# EAGLE design brick_i2c_humidity (EAGLE 7.3.0)
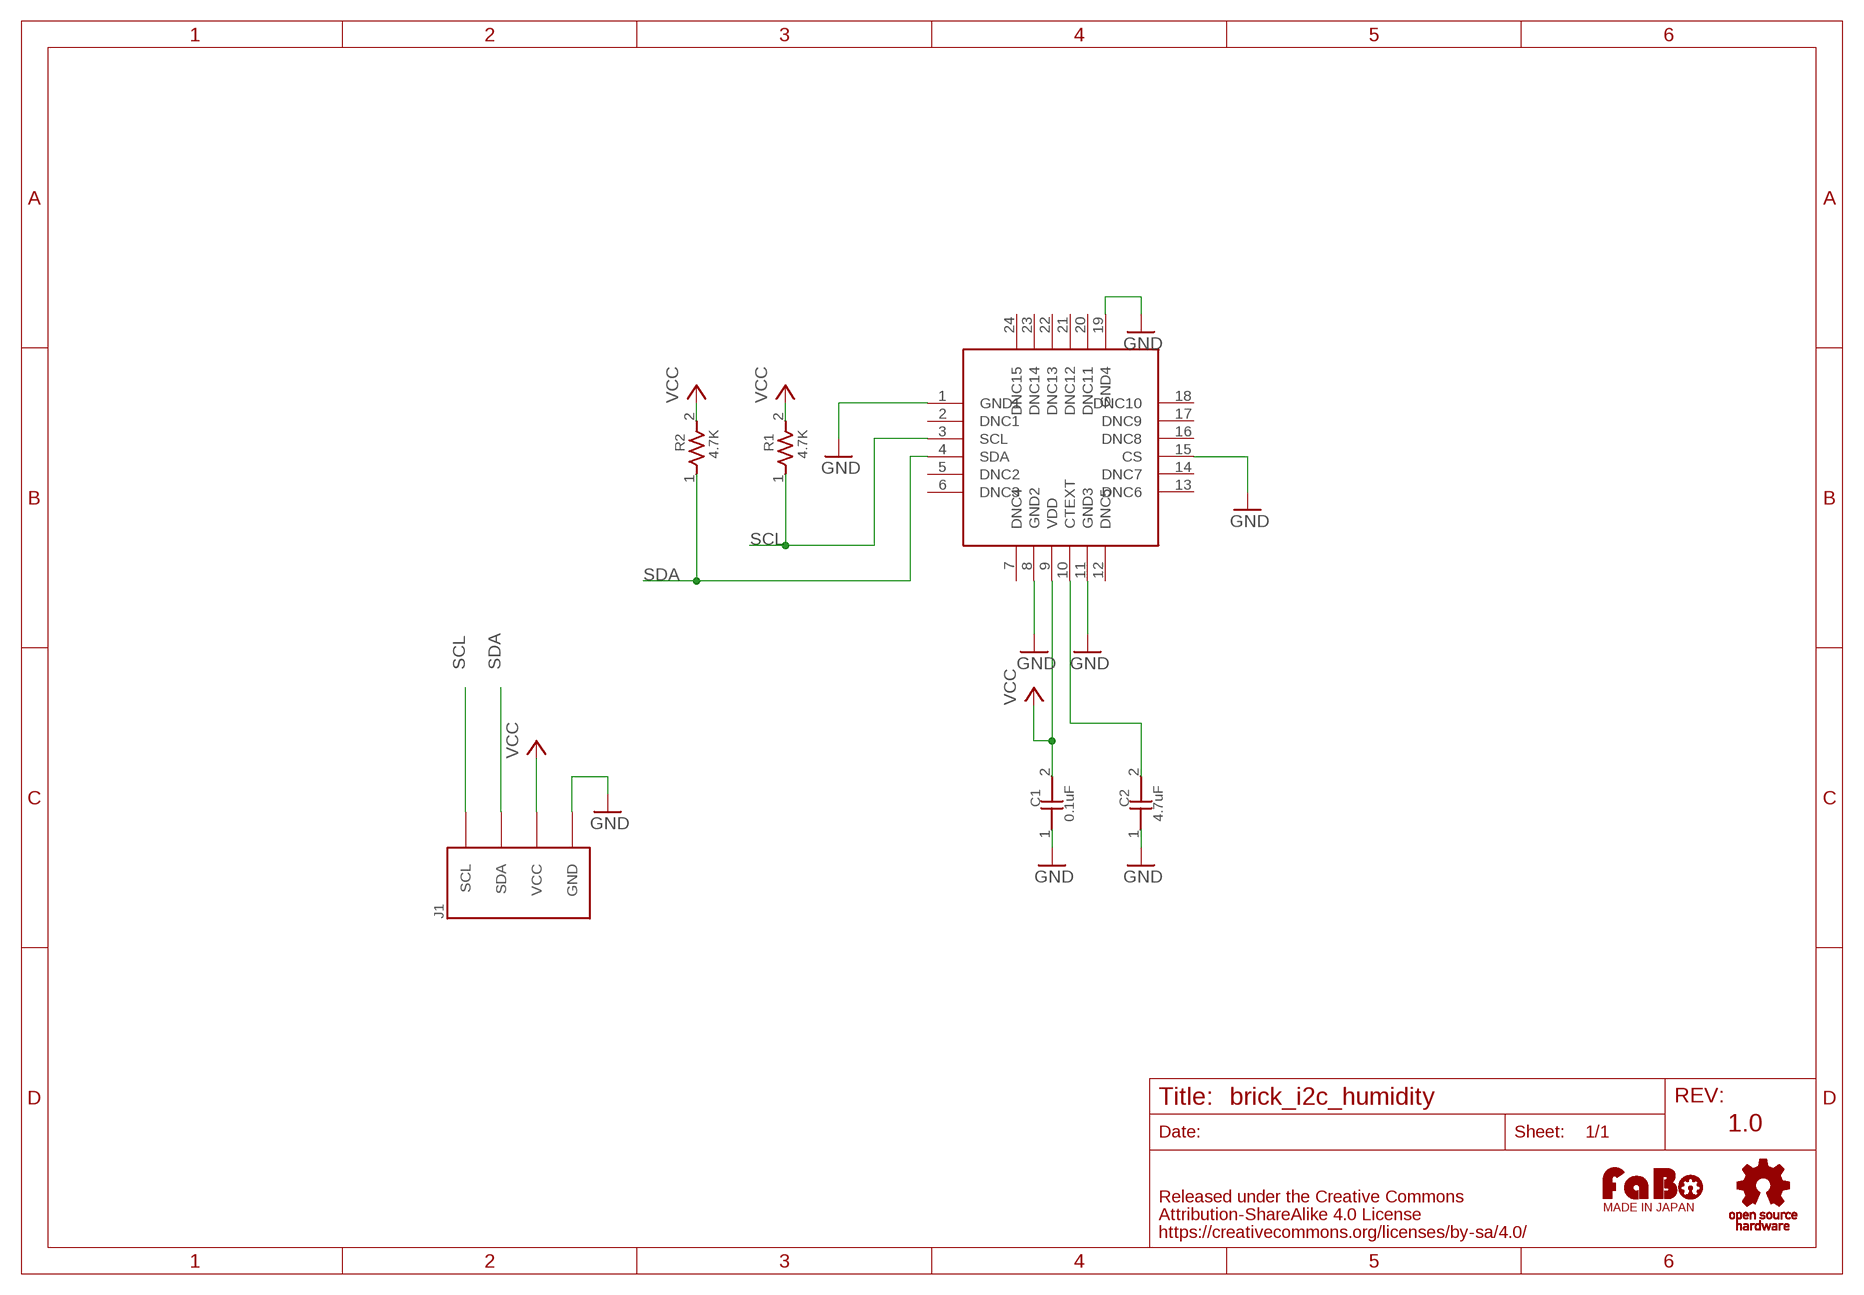
[diagram p0: schematic, sheet 1]

## Parts
C1  0.1uF  CAPACITOR0603  [0603]
C2  4.7uF  CAPACITOR0603  [0603]
J1  BRICK_I2C  [BRICK_I2C]
R1  4.7K  RESISTOR0603  [0603]
R2  4.7K  RESISTOR0603  [0603]
SI1  SILICONLAB-SI7005  [SILICONLAB-SI7005]
U$2  LOGO_FABO-M  [LOGO_FABO_M]
U$4  LOGO_OSHW_T-M  [LOGO_OSHW_T_M]

## Nets
GND: C1.1 C2.1 J1.GND SI1.1(GND1) SI1.8(GND2) SI1.11(GND3) SI1.15(CS) SI1.19(GND4)
N$1: C2.2 SI1.10(CTEXT)
SCL: J1.SCL R1.1 SI1.3(SCL)
SDA: J1.SDA R2.1 SI1.4(SDA)
VCC: C1.2 J1.VCC R1.2 R2.2 SI1.9(VDD)
Unconnected: SI1.2(DNC1) SI1.5(DNC2) SI1.6(DNC3) SI1.7(DNC4) SI1.12(DNC5) SI1.13(DNC6) SI1.14(DNC7) SI1.16(DNC8) SI1.17(DNC9) SI1.18(DNC10) SI1.20(DNC11) SI1.21(DNC12) SI1.22(DNC13) SI1.23(DNC14) SI1.24(DNC15)

## Notes on the sheet
- 1.0

## Library data of the parts
C1 C2 = GClue-Capacitor:CAPACITOR
J1 = gclue:BRICK_I2C: FaBo Brick 4pin(I2C)
R1 R2 = GClue-Resistors:RESISTOR
SI1 = gclueSensor:SILICONLAB-SI7005
U$2 = FaBo:LOGO_FABO
U$4 = gclue:LOGO_OSHW_T

## Board
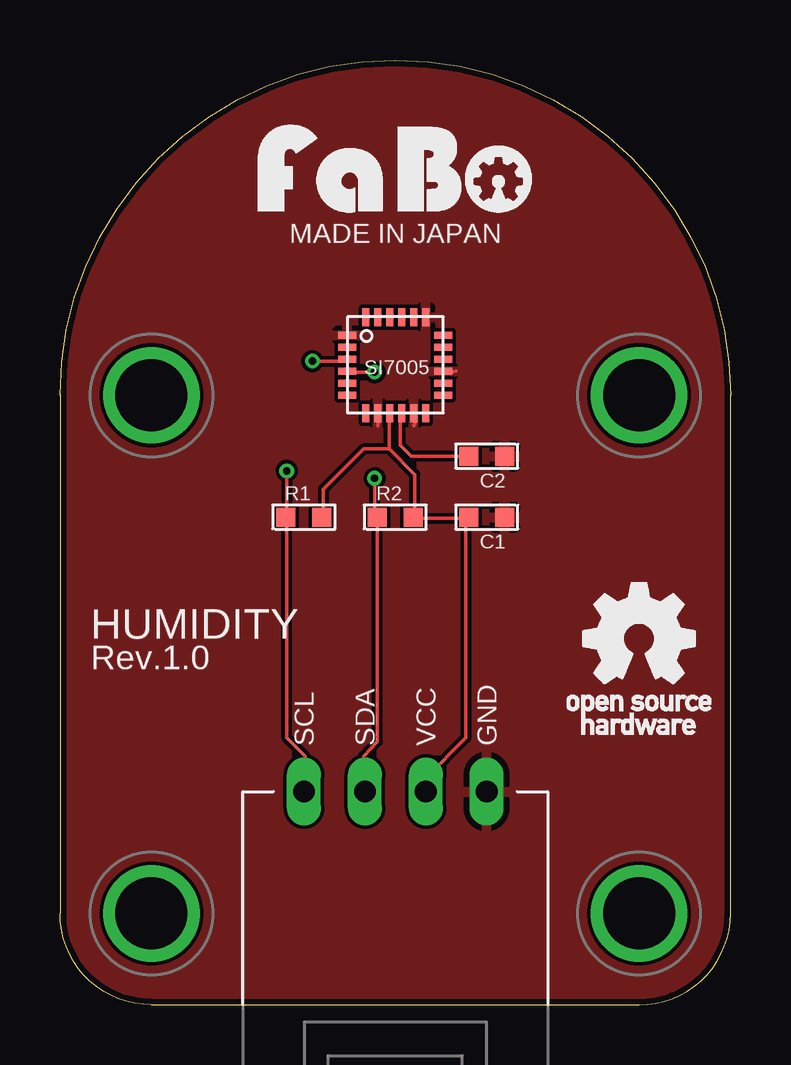
[diagram p1: board, top side]
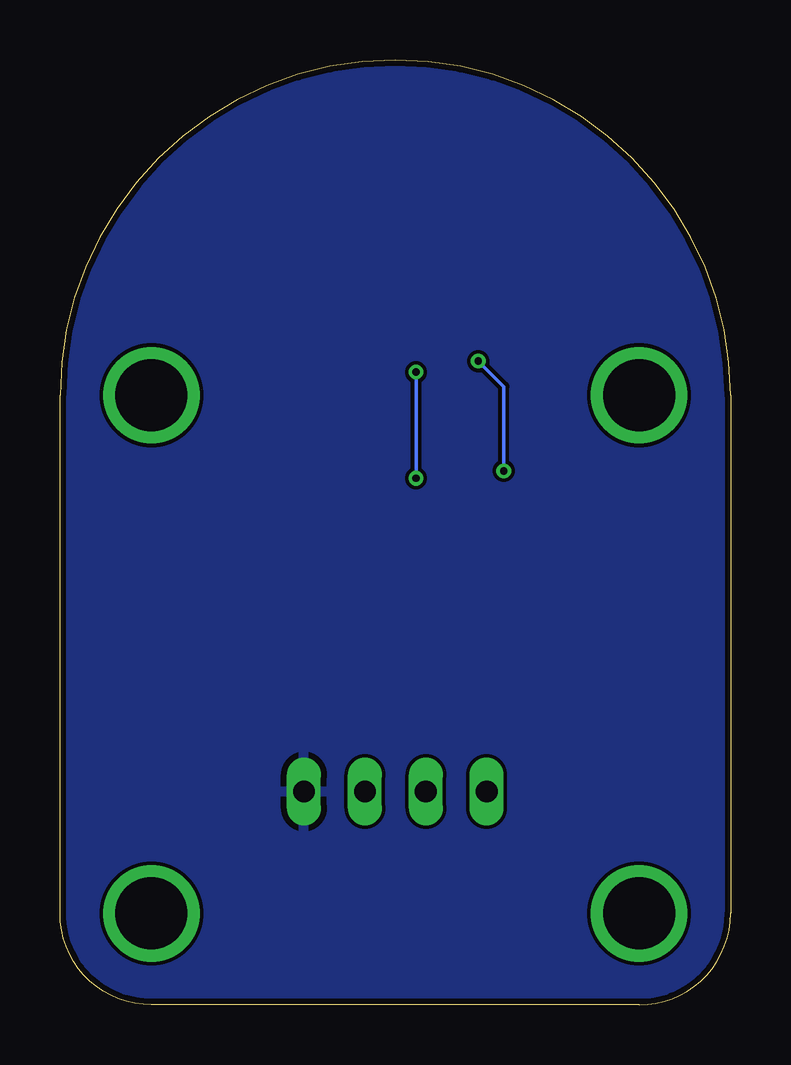
[diagram p2: board, bottom side, seen from below]

Size 27.94 x 39.37 mm. Coordinates in mm from the lower left corner, seen from the top.
Copper layers (1*16): Top 0.035mm / dielectric 1.5mm / Bottom 0.035mm
Design rules "Elecrow_2-layer_eagle_rule": minimum track width 6mil, minimum drill 12mil, track to track 6mil, track to pad 6mil, pad to pad 6mil, via to via 6mil, smd to smd 0mil, copper to edge 10mil, drill to drill 10mil, minimum pad ring 10mil, minimum via ring 6mil, stop-mask expansion 2mil, vias tented up to drill 100mil, thermal gap 10mil

### Footprints (pad centres in the part's own frame; a part is rotated, then mirrored left to right if it is on the bottom)
0603 = smd 0.8 x 0.8: 1 -0.75,0; 2 0.75,0
BRICK_I2C = drill 0.9 long: GND 3.81,-10.16; SCL -3.81,-10.16; SDA -1.27,-10.16; VCC 1.27,-10.16 | drill 3 pad 3.81: P$1 -10.16,6.35; P$2 10.16,6.35; P$3 -10.16,-15.24; P$4 10.16,-15.24
SILICONLAB-SI7005 = smd 0.75 x 0.3: 1 -2.01,1.23; 2 -2.01,0.73; 3 -2.01,0.23; 4 -2.01,-0.27; 5 -2.01,-0.77; 6 -2.01,-1.27; 13 1.99,-1.27; 14 1.99,-0.77; 15 1.99,-0.27; 16 1.99,0.23; 17 1.99,0.73; 18 1.99,1.23 | smd 0.3 x 0.75: 7 -1.23,-2.01; 8 -0.73,-2.01; 9 -0.23,-2.01; 10 0.27,-2.01; 11 0.77,-2.01; 12 1.27,-2.01; 19 1.27,1.99; 20 0.77,1.99; 21 0.27,1.99; 22 -0.23,1.99; 23 -0.73,1.99; 24 -1.23,1.99

### Placement (x,y rotation side)
C1  17.78,20.32 180 top
C2  17.78,22.86 180 top
J1  13.97,19.05 0 top
R1  10.16,20.32 0 top
R2  13.97,20.32 0 top
SI1  13.97,26.67 0 top
U$2  13.97,33.02 0 top
U$4  24.13,15.24 0 top

### Tracks (layer width: path | path; a pad name or v marks a point on that pad's centre or on a via)
GND
  Top 0.152: SI1.8 13.26,24.54 13.26,24.23 13.24,24.13 | SI1.11 14.78,24.54 14.78,24.23 14.74,24.13 | SI1.15 16,26.36 16.31,26.36 16.49,26.4
  pour Bottom: -1.27,-1.27 29.21,-1.27 29.21,40.64 -1.27,40.64
  pour Top: -1.27,-1.27 29.21,-1.27 29.21,40.64 -1.27,40.64
N$1
  Top 0.152: C2.2 14.63,22.86 14.17,23.32 14.17,24.54 SI1.10
SCL  (via drill 0.3)
  Top 0.152: v10.52,26.82 11.89,26.82 SI1.3 | J1.SCL 10.21,8.99 10.21,10.36 9.45,11.12 9.45,20.27 R1.1 9.41,20.38 9.45,20.42 v9.45,22.25
  Bottom 0.152: v10.52,26.82 9.45,25.76 v9.45,22.25
SDA  (via drill 0.3)
  Top 0.152: v13.11,26.36 12.04,26.36 SI1.4 | v13.11,21.95 13.11,20.42 R2.1 13.22,10.97 12.65,10.36 12.65,8.99 J1.SDA
  Bottom 0.152: v13.11,21.95 v13.11,26.36
VCC
  Top 0.152: 13.72,23.16 13.72,24.54 SI1.9 | 13.72,23.16 14.78,22.1 14.78,20.42 R2.2 14.78,20.27 16.92,20.27 | 13.72,23.16 12.65,23.16 10.97,21.49 10.97,20.42 R1.2 | J1.VCC 15.24,9.45 16.92,11.12 16.92,20.27 | 16.92,20.27 C1.2

### Text on the board
tPlace: MADE IN JAPAN | HUMIDITY | Rev.1.0